# Altium schematic sheet WiFi module.SchDoc: RK3399 SOM Module
size A4; Date: 23.05.2023; Author: Łukasz Nowarkiewicz; SheetNumber: 4; SheetTotal: 21; RegistrationBookNumber: 144201; title_sheet: WiFi Module
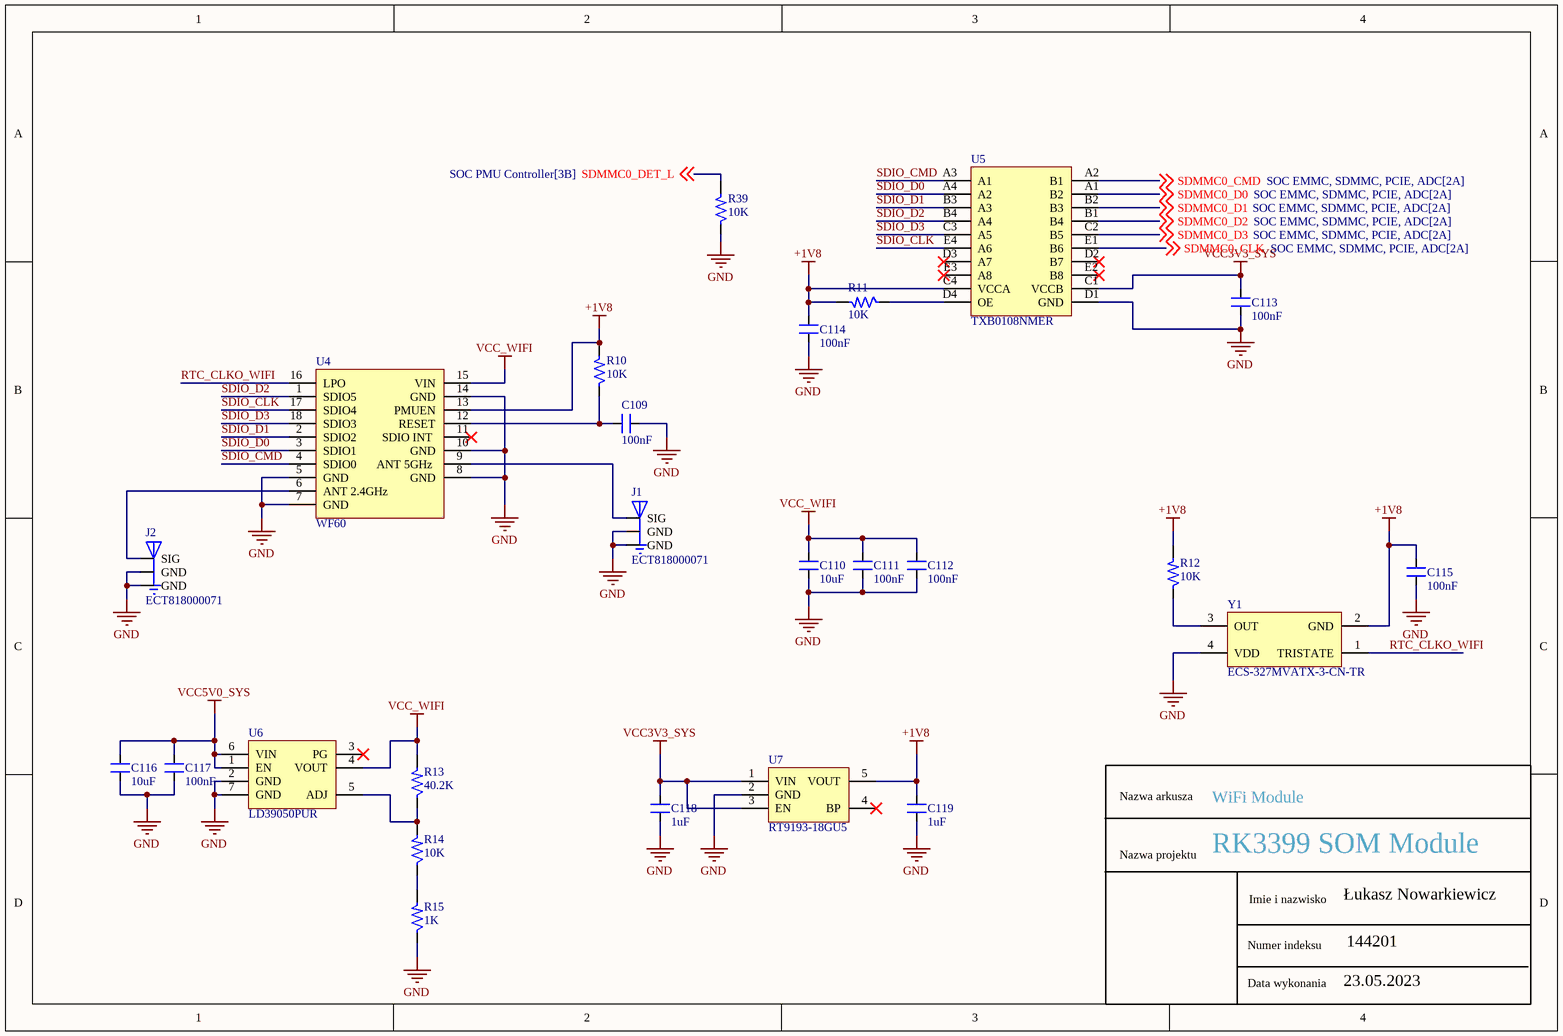
[diagram p0: WiFi module.SchDoc]

## Parts
C109  100nF  [CAP_0402]
C110  10uF  [CAP_0603]
C111  100nF  [CAP_0402]
C112  100nF  [CAP_0402]
C113  100nF  [CAP_0402]
C114  100nF  [CAP_0402]
C115  100nF  [CAP_0402]
C116  10uF  [CAP_0603]
C117  100nF  [CAP_0402]
C118  1uF  [CAP_0402]
C119  1uF  [CAP_0402]
J1  ECT818000071  [CON3_UFL_116_SMD_ST]
J2  ECT818000071  [CON3_UFL_116_SMD_ST]
R10  10K  [RES_0201]
R11  10K  [RES_0201]
R12  10K  [RES_0201]
R13  40.2K  [RES_0201]
R14  10K  [RES_0201]
R15  1K  [RES_0201]
R39  10K  [RES_0402]
U4  WF60  [MOD_WF60]
U5  TXB0108NMER  [NFBGA_31.4_125.9X102.36]
U6  LD39050PUR  [DFN-6_37.4_165_33X15_SMD]
U7  RT9193-18GU5  [SC70-5]
Y1  ECS-327MVATX-3-CN-TR  [XTAL_57_35X31_SMD]

## Nets
+1V8: C114.2 C115.2 C119.2 R10.2 R11.2 R12.2 U4.13(PMUEN) U5.C4(VCCA) U7.5(VOUT) Y1.2(GND)
GND: C109.2 C110.1 C111.1 C112.2 C113.1 C114.1 C115.1 C116.1 C117.1 C118.1 C119.1 J1.1(GND) J1.3(GND) J2.1(GND) J2.3(GND) R15.1 R39.1 U4.5(GND) U4.7(GND) U4.8(GND) U4.10(GND) U4.14(GND) U5.D1(GND) U6.2(GND) U6.7(GND) U7.2(GND) Y1.4(VDD)
VCC3V3_SYS: C113.2 C118.2 U5.C1(VCCB) U7.1(VIN) U7.3(EN)
VCC5V0_SYS: C116.2 C117.2 U6.1(EN) U6.6(VIN)
VCC_WIFI: C110.2 C111.2 C112.1 R13.2 U4.15(VIN) U6.4(VOUT)
RTC_CLKO_WIFI: U4.16(LPO) Y1.1(TRISTATE)
SDIO_CLK: U4.17(SDIO4) U5.E4(A6)
SDIO_CMD: U4.4(SDIO0) U5.A3(A1)
SDIO_D0: U4.3(SDIO1) U5.A4(A2)
SDIO_D1: U4.2(SDIO2) U5.B3(A3)
SDIO_D2: U4.1(SDIO5) U5.B4(A4)
SDIO_D3: U4.18(SDIO3) U5.C3(A5)
SDMMC0_CLK: U5.E1(B6) ; off-sheet SDMMC0_CLK
SDMMC0_CMD: U5.A2(B1) ; off-sheet SDMMC0_CMD
SDMMC0_D0: U5.A1(B2) ; off-sheet SDMMC0_D0
SDMMC0_D1: U5.B2(B3) ; off-sheet SDMMC0_D1
SDMMC0_D2: U5.B1(B4) ; off-sheet SDMMC0_D2
SDMMC0_D3: U5.C2(B5) ; off-sheet SDMMC0_D3
SDMMC0_DET_L: R39.2 ; off-sheet SDMMC0_DET_L
NetC109_1: C109.1 R10.1 U4.12(RESET)
NetJ1_2: J1.2(SIG) U4.9(ANT_5GHz)
NetJ2_2: J2.2(SIG) U4.6(ANT_2.4GHz)
NetR11_1: R11.1 U5.D4(OE)
NetR12_1: R12.1 Y1.3(OUT)
NetR13_1: R13.1 R14.2 U6.5(ADJ)
NetR14_1: R14.1 R15.2

Not connected (* = marked no-connect by the designer): U4 11(SDIO_INT_)*; U5 D2(B7)* D3(A7)* E2(B8)* E3(A8)*; U6 3(PG)*; U7 4(BP)*

## Notes on the sheet
- Nazwa arkusza
- Nazwa projektu
- Imie i nazwisko
- Data wykonania
- Numer indeksu

## Library data of the parts
C109 C111-C115 C117 = CAP_100nF-10V-10%-0402: 0.1µF ±10% 10V Ceramic Capacitor X7R 0402 (1005 Metric); Manufacturer: Yageo; Manufacturer Part Number: CC0402KRX7R6BB104; Case/Package: 0402; Supplier-1: Digikey
C110 C116 = CAP_10uF-10V-10%-0603: 10µF ±10% 10V Ceramic Capacitor X5R 0603 (1608 Metric); Manufacturer Part Number: GRM188R61A106KE69J; Manufacturer: Murata Electronics; Case/Package: 0603; Supplier-1: Digikey
C118 C119 = CAP_1uF-10V-10%-0402: 1µF ±10% 10V Ceramic Capacitor X6S 0402 (1005 Metric); Manufacturer: Murata Electronics; Manufacturer Part Number: GRT155C81A105KE01D; Case/Package: 0402; Supplier-1: Digikey
J1 J2 = CON-PLG_3X1-ECT818000071-ST-SMD: SMD RF Connectors/Coaxial Connectors RoHS; Manufacturer: ECT; Manufacturer Part Number: ECT818000071; Case/Package: SMD; Supplier-1: LCSC
R10-R12 R14 = RES_10K-0.05W-1%-0201: 10 kOhms ±1% 0.05W, 1/20W Chip Resistor 0201 (0603 Metric) Thick Film; Manufacturer: Stackpole Electronics Inc; Manufacturer Part Number: RMCF0201FT10K0; Case/Package: 0201; Supplier-1: Digikey
R13 = RES_40.2K-0.05W-1%-0201: 40.2 kOhms ±1% 0.05W, 1/20W Chip Resistor 0201 (0603 Metric) Automotive AEC-Q200, Moisture Resistant Thick Film; Manufacturer: Yageo; Manufacturer Part Number: AC0201FR-0740K2L; Case/Package: 0201; Supplier-1: Digikey
R15 = RES_1K-0.05W-1%-0201: 1 kOhms ±1% 0.05W, 1/20W Chip Resistor 0201 (0603 Metric) Thick Film; Manufacturer: Yageo; Manufacturer Part Number: RC0201FR-071KL; Case/Package: 0201; Supplier-1: Digikey
R39 = RES_10K-0.1W-1%-0402: 10 kOhms ±1% 0.1W, 1/10W Chip Resistor 0402 (1005 Metric) Anti-Sulfur Thin Film; Manufacturer: Vishay Beyschlag/Draloric/BC Components; Manufacturer Part Number: MCS04020C1002FE000; Case/Package: 0402; Supplier-1: Digikey
U4 = MOD_WF60-SMD: Amp’ed RF Tech presents the WF60 WiFi dual / band module: 802.11abgn.; Alternate Part Number-1: NA; Manufacturer: Amp’ed; Manufacturer Part Number: WF60; Case/Package: SMD; Supplier-1: Arrow; Supplier Part Number-1: WF60; Category: Module; Number of Pins: 16
U5 = IC_TXB0108NMER: Translation - Voltage Levels 8-Bit Bidirectional Voltage-Level Shifter with Auto Direction Sensing and +/-15-kV ESD Protect; Manufacturer: Texas Instruments; Manufacturer Part Number: TXB0108NMER; Case/Package: NFBGA-20; Supplier-1: Mouser
U6 = REG_5.5V-0~5.1V-0.5A-2.55W-DFN-6: Adjustable 5.5V 0.8V 500mA DFN-6 Linear Voltage Regulators RoHS; Manufacturer: STMicroelectronics; Alternate Part Number-1: NA; Manufacturer Part Number: LD39050PUR; Case/Package: DFN-6; Supplier-1: LCSC; Supplier Part Number-1: C222094; Category: Regulators; Number of Pins: 6
U7 = REG_1.8V-300mA-5.5V-SC70-5: Linear Voltage Regulator IC 1 Output 300mA SC-70-5; Manufacturer: Richtek USA Inc.; Manufacturer Part Number: RT9193-18GU5; Case/Package: SC70-5; Supplier-1: Digikey
Y1 = XTAL_ECS-327MVATX-2-CN-TR: 32.768kHz XO (Standard) CMOS Oscillator 1.6V ~ 3.6V Enable/Disable 4-SMD, No Lead; Manufacturer: ECS INC; Alternate Part Number-1: NA; Manufacturer Part Number: ECS-327MVATX-3-CN-TR; Case/Package: SMD-4; Supplier-1: Digikey; Supplier Part Number-1: ECS-327MVATX-3-CN-TR; Category: Crystal; Number of Pins: 4